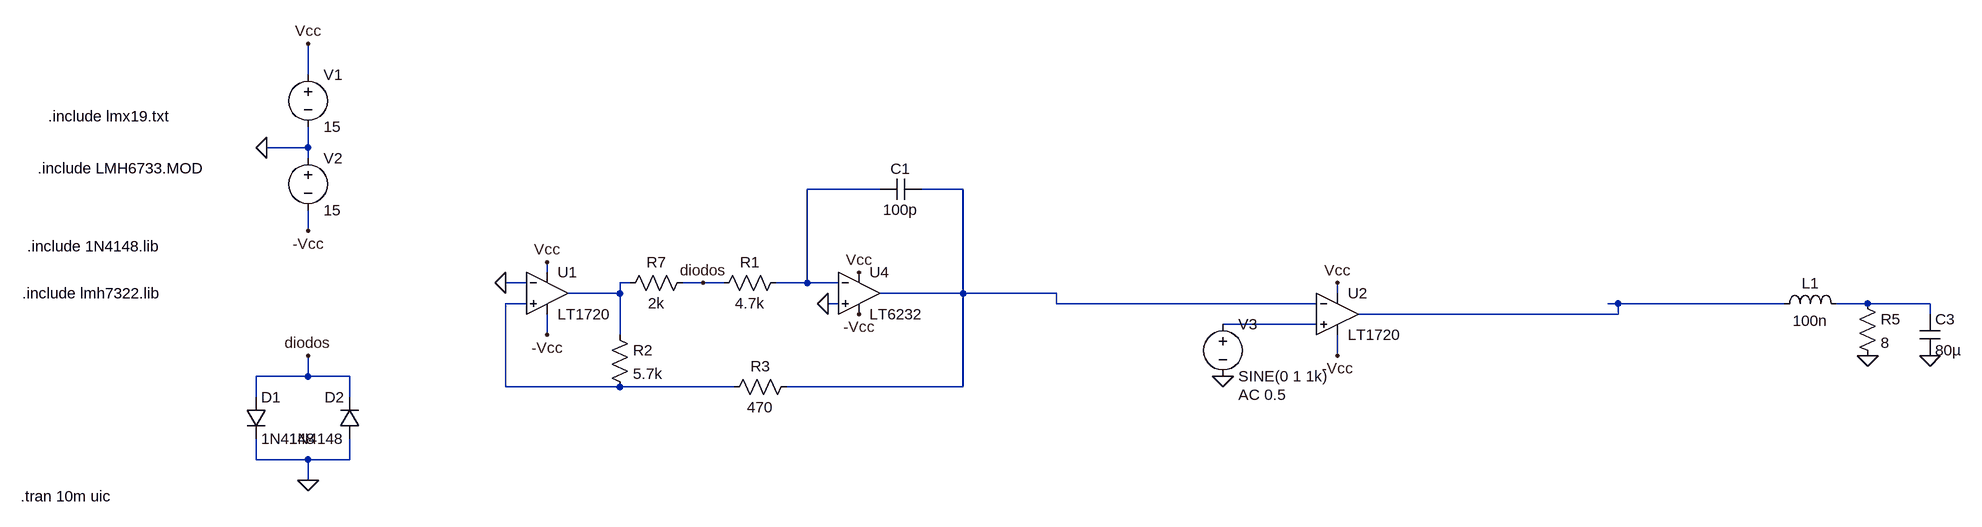
[diagram p0: schematic entrada-300k.asc]
entrada-300k.asc, the LTspice schematic file:
Version 4
SHEET 1 2216 680
WIRE -336 -16 -336 -64
WIRE -336 96 -336 64
WIRE -336 96 -400 96
WIRE -336 112 -336 96
WIRE 544 160 432 160
WIRE 672 160 608 160
WIRE -336 224 -336 192
WIRE 32 288 32 272
WIRE 0 304 -32 304
WIRE 160 304 144 304
WIRE 272 304 240 304
WIRE 304 304 272 304
WIRE 432 304 432 160
WIRE 432 304 384 304
WIRE 480 304 432 304
WIRE 144 320 144 304
WIRE 144 320 64 320
WIRE 672 320 672 160
WIRE 672 320 544 320
WIRE 816 320 672 320
WIRE 1248 320 1248 304
WIRE 0 336 -32 336
WIRE 480 336 464 336
WIRE 816 336 816 320
WIRE 1216 336 816 336
WIRE 1680 336 1664 336
WIRE 1936 336 1680 336
WIRE 2064 336 2016 336
WIRE 2160 336 2064 336
WIRE 1680 352 1680 336
WIRE 1680 352 1280 352
WIRE 2160 352 2160 336
WIRE 1216 368 1072 368
WIRE 32 384 32 352
WIRE 144 384 144 320
WIRE 1248 416 1248 384
WIRE -336 448 -336 416
WIRE -336 448 -416 448
WIRE -272 448 -336 448
WIRE -32 464 -32 336
WIRE 144 464 -32 464
WIRE 320 464 144 464
WIRE 672 464 672 320
WIRE 672 464 400 464
WIRE -416 480 -416 448
WIRE -272 480 -272 448
WIRE -416 576 -416 544
WIRE -336 576 -416 576
WIRE -272 576 -272 544
WIRE -272 576 -336 576
WIRE -336 608 -336 576
FLAG -400 96 0
FLAG -336 -64 Vcc
FLAG -336 224 -Vcc
FLAG 32 272 Vcc
FLAG 32 384 -Vcc
FLAG 512 288 Vcc
FLAG 512 352 -Vcc
FLAG 464 336 0
FLAG -32 304 0
FLAG -336 608 0
FLAG -336 416 diodos
FLAG 272 304 diodos
FLAG 1248 304 Vcc
FLAG 1248 416 -Vcc
FLAG 1072 448 0
FLAG 2064 416 0
FLAG 2160 416 0
SYMBOL voltage -336 -32 R0
SYMATTR InstName V1
SYMATTR Value 15
SYMBOL voltage -336 96 R0
WINDOW 123 0 0 Left 2
WINDOW 39 0 0 Left 2
SYMATTR InstName V2
SYMATTR Value 15
SYMBOL cap 608 144 R90
WINDOW 0 0 32 VBottom 2
WINDOW 3 32 32 VTop 2
SYMATTR InstName C1
SYMATTR Value 100p
SYMBOL res 400 288 R90
WINDOW 0 0 56 VBottom 2
WINDOW 3 32 56 VTop 2
SYMATTR InstName R1
SYMATTR Value 4.7k
SYMBOL res 128 368 R0
SYMATTR InstName R2
SYMATTR Value 5.7k
SYMBOL res 416 448 R90
WINDOW 0 0 56 VBottom 2
WINDOW 3 32 56 VTop 2
SYMATTR InstName R3
SYMATTR Value 470
SYMBOL diode -432 480 R0
SYMATTR InstName D1
SYMATTR Value 1N4148
SYMBOL diode -256 544 R180
WINDOW 0 24 64 Left 2
WINDOW 3 24 0 Left 2
SYMATTR InstName D2
SYMATTR Value 1N4148
SYMBOL res 256 288 R90
WINDOW 0 0 56 VBottom 2
WINDOW 3 32 56 VTop 2
SYMATTR InstName R7
SYMATTR Value 2k
SYMBOL voltage 1072 352 R0
WINDOW 123 24 124 Left 2
WINDOW 39 0 0 Left 2
SYMATTR Value2 AC 0.5
SYMATTR InstName V3
SYMATTR Value SINE(0 1 1k)
SYMBOL ind 2032 352 M270
WINDOW 0 32 56 VTop 2
WINDOW 3 5 56 VBottom 2
SYMATTR InstName L1
SYMATTR Value 100n
SYMBOL res 2048 320 R0
SYMATTR InstName R5
SYMATTR Value 8
SYMBOL cap 2144 352 R0
SYMATTR InstName C3
SYMATTR Value 80µ
SYMBOL Opamps\\LT6232 512 320 R0
SYMATTR InstName U4
SYMBOL Comparators\\LT1720 1248 288 R0
SYMATTR InstName U2
SYMBOL Comparators\\LT1720 32 256 R0
SYMATTR InstName U1
TEXT -752 128 Left 2 !.include LMH6733.MOD
TEXT -768 248 Left 2 !.include 1N4148.lib
TEXT -736 48 Left 2 !.include lmx19.txt
TEXT -776 320 Left 2 !.include lmh7322.lib
TEXT -778 632 Left 2 !.tran 10m uic

The netlist it stands for:
* entrada-300k.asc
V1 Vcc 0 15
V2 0 -Vcc 15
C1 N002 N001 100p
R1 N001 diodos 4.7k
R2 N003 N004 5.7k
R3 N002 N004 470
D1 diodos 0 1N4148
D2 0 diodos 1N4148
R7 diodos N003 2k
V3 N007 0 SINE(0 1 1k) AC 0.5
L1 N006 N005 100n
R5 N006 0 8
C3 N006 0 80µ
* U4: LT6232 (symbol Opamps\LT6232 not available, pins judged from their places): In+=0 In-=N001 V+=Vcc V-=-Vcc OUT=N002
XU2 N007 N002 Vcc -Vcc N005 LT1720  ; pins In+ In- V+ V- OUT
XU1 N004 0 Vcc -Vcc N003 LT1720  ; pins In+ In- V+ V- OUT
.model D D
.lib standard.dio
.include LMH6733.MOD
.include 1N4148.lib
.include lmx19.txt
.include lmh7322.lib
.tran 10m uic
.lib LT1720.sub
.backanno
.end